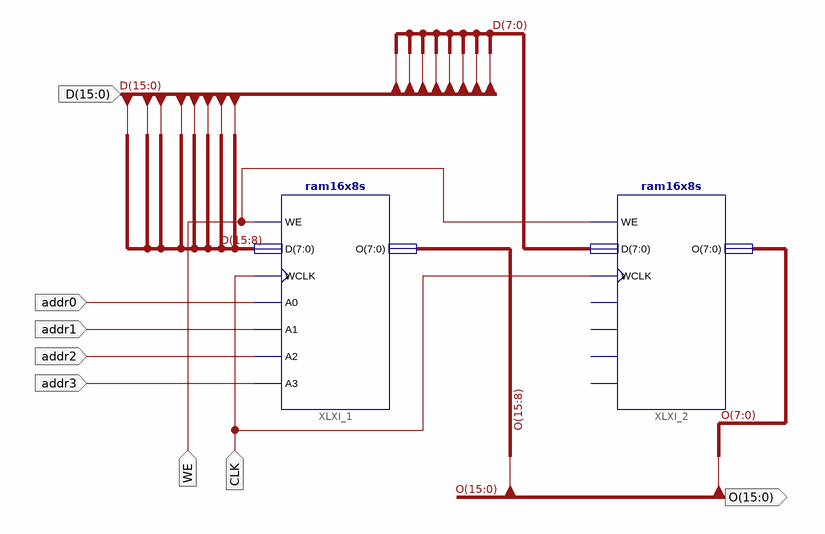
[diagram p0: schematic sheet 1]
// Xilinx ISE schematic RAM16X16s.sch (spartan3e) as structural Verilog: 2 symbols, 8 ports
module RAM16X16s (
  input  [15:0] D,
  input  CLK,
  input  WE,
  input  addr0,
  input  addr1,
  input  addr2,
  input  addr3,
  output [15:0] O
);

  ram16x8s XLXI_1 (.A0(addr0), .A1(addr1), .A2(addr2), .A3(addr3), .D(D[15:8]), .WCLK(CLK), .WE(WE), .O(O[15:8]));
  ram16x8s XLXI_2 (.D(D[7:0]), .WCLK(CLK), .WE(WE), .O(O[7:0]));  // open: A0, A1, A2, A3
endmodule
